# EAGLE schematic Piano Circuit desgin Schematic (EAGLE 9.6.2)
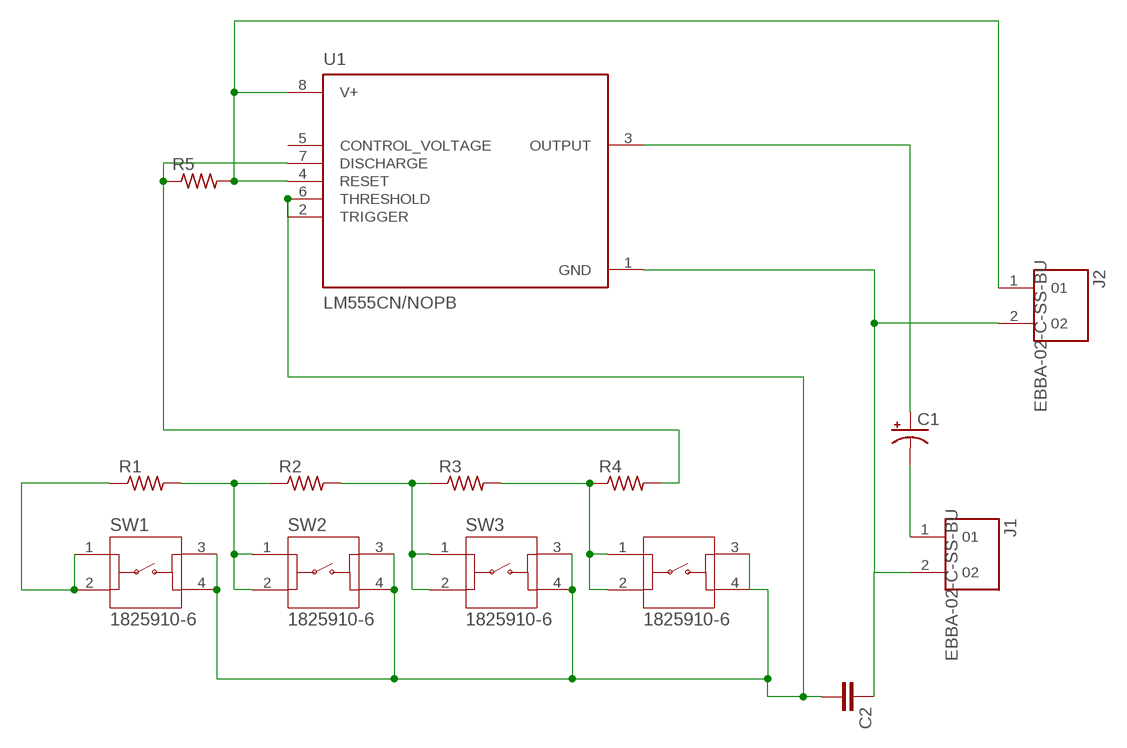
[diagram p0: schematic, sheet 1]

## Parts
C1  CPOL-USE2-4  [E2-4]
C2  C-EU025-025X050  [C025-025X050]
J1  EBBA-02-C-SS-BU  [EBBA-02-C-SS-BU]
J2  EBBA-02-C-SS-BU  [EBBA-02-C-SS-BU]
R1  R-US_0204/7  [0204/7]
R2  R-US_0204/7  [0204/7]
R3  R-US_0204/7  [0204/7]
R4  R-US_0204/7  [0204/7]
R5  R-US_0204/7  [0204/7]
SW1  1825910-6  [SW_1825910-6-4]
SW2  1825910-6  [SW_1825910-6-4]
SW3  1825910-6  [SW_1825910-6-4]
SW4  1825910-6  [SW_1825910-6-4]
U1  LM555CN/NOPB  [DIP794W45P254L959H508Q8]

## Nets
N$1: R1.2 R2.1 SW2.1 SW2.2
N$2: R2.2 R3.1 SW3.1 SW3.2
N$3: R3.2 R4.1 SW4.1 SW4.2
N$4: R1.1 SW1.1 SW1.2
N$6: C2.1 J1.2 J2.2 U1.1(GND)
N$7: C1.+ U1.3(OUTPUT)
N$8: C1.- J1.1
N$9: J2.1 R5.2 U1.4(RESET) U1.8(V+)
N$11: C2.2 SW1.3 SW1.4 SW2.3 SW2.4 SW3.3 SW3.4 SW4.3 SW4.4 U1.2(TRIGGER) U1.6(THRESHOLD)
N$12: R4.2 R5.1 U1.7(DISCHARGE)
Unconnected: U1.5(CONTROL_VOLTAGE)

## Library data of the parts
C1 = rcl:CPOL-US: POLARIZED CAPACITOR, American symbol; SPICEPREFIX: C
C2 = rcl:C-EU: CAPACITOR, European symbol; SPICEPREFIX: C
J1 J2 = EBBA-02-C-SS-BU:EBBA-02-C-SS-BU: Check availability <https://pricing.snapeda.com/parts/EBBA-02-C-SS-BU/Adam%20Tech/view-part?ref=eda>; AVAILABILITY: In Stock; CHECK_PRICES: https://www.snapeda.com/parts/EBBA-02-C-SS-BU/Adam+Tech/view-part/?ref=eda; DESCRIPTION: Terminal block, EURO BLOCK, slotted screw, 5.00mm pitch, blue, 2 position | Adam Tech EBBA-02-C-SS-BU; MF: Adam Tech; MP: EBBA-02-C-SS-BU; PACKAGE: None; PRICE: None; SNAPEDA_LINK: https://www.snapeda.com/parts/EBBA-02-C-SS-BU/Adam+Tech/view-part/?ref=snap
R1-R5 = rcl:R-US_: RESISTOR, American symbol; SPICEPREFIX: R
SW1-SW4 = 1825910-6:1825910-6: Check availability <https://pricing.snapeda.com/parts/1825910-6/TE%20Connectivity/view-part?ref=eda>; AVAILABILITY: In Stock; CHECK_PRICES: https://www.snapeda.com/parts/1825910-6/TE+Connectivity+Alcoswitch+Switches/view-part/?ref=eda; COMMENT: 1825910-6; DESCRIPTION: Switch Push Button OFF (ON) SPST Round Button 0.05A 24VDC Momentary Contact PC Pins Thru-Hole; MF: TE Connectivity; MP: 1825910-6; PACKAGE: None; PRICE: None; SNAPEDA_LINK: https://www.snapeda.com/parts/1825910-6/TE+Connectivity+Alcoswitch+Switches/view-part/?ref=snap
U1 = LM555CN_NOPB:LM555CN/NOPB: Check availability <https://pricing.snapeda.com/parts/LM555CN/NOPB/Texas%20Instruments/view-part?ref=eda>; AVAILABILITY: In Stock; CHECK_PRICES: https://www.snapeda.com/parts/LM555CN/NOPB/Texas+Instruments/view-part/?ref=eda; DESCRIPTION: Highly Stable 555 Timer; MF: Texas Instruments; MP: LM555CN/NOPB; PACKAGE: PDIP-8 Texas; PRICE: None; SNAPEDA_LINK: https://www.snapeda.com/parts/LM555CN/NOPB/Texas+Instruments/view-part/?ref=snap